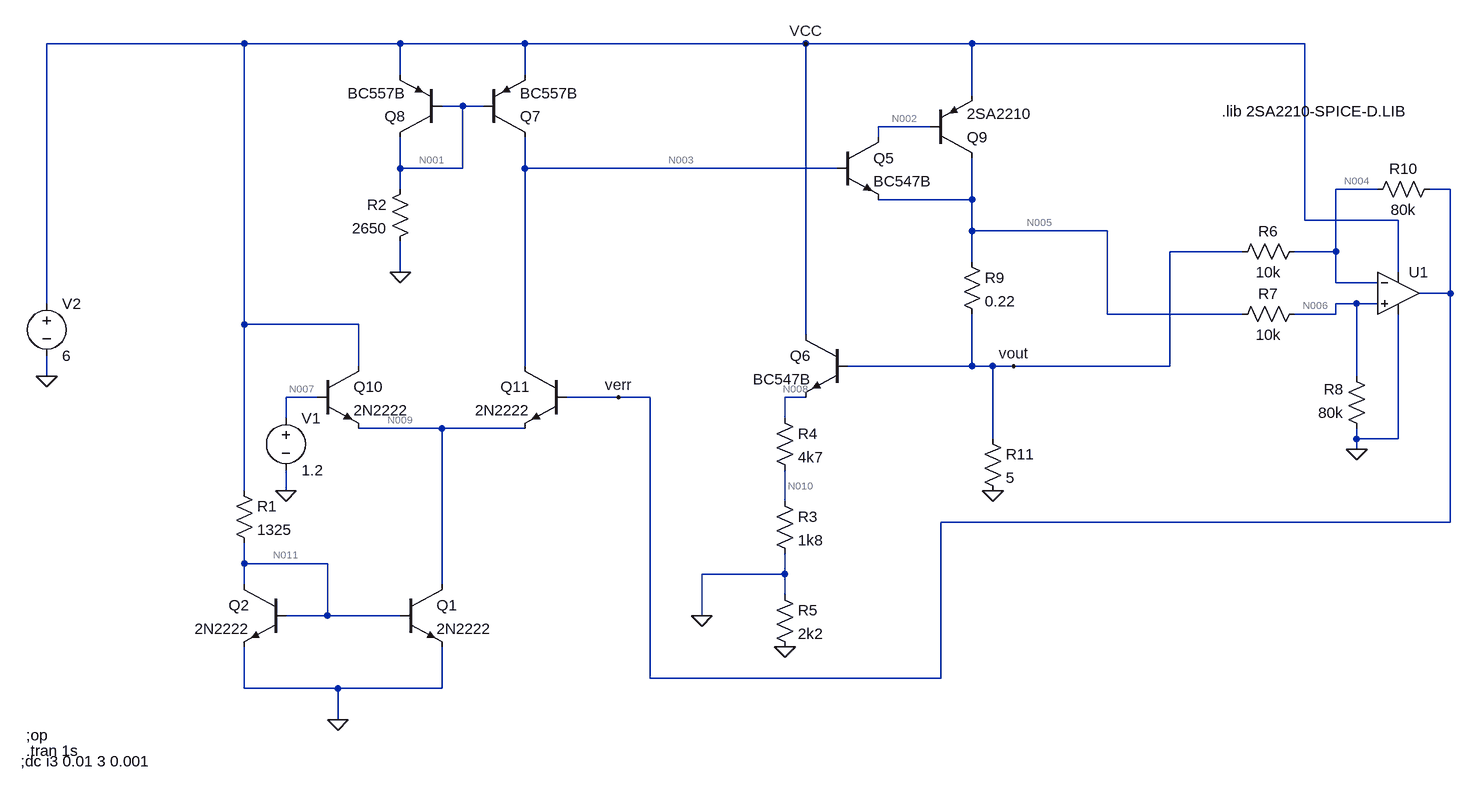
[diagram p0: schematic modelo_1_2_opamp.asc]
modelo_1_2_opamp.asc, the LTspice schematic file:
Version 4
SHEET 1 3060 680
WIRE -128 -496 -432 -496
WIRE 112 -496 -128 -496
WIRE 304 -496 112 -496
WIRE 736 -496 304 -496
WIRE 992 -496 736 -496
WIRE 1504 -496 992 -496
WIRE 112 -448 112 -496
WIRE 304 -448 304 -496
WIRE 992 -416 992 -496
WIRE 208 -400 176 -400
WIRE 240 -400 208 -400
WIRE 928 -368 848 -368
WIRE 848 -352 848 -368
WIRE 112 -304 112 -352
WIRE 208 -304 208 -400
WIRE 208 -304 112 -304
WIRE 304 -304 304 -352
WIRE 784 -304 304 -304
WIRE 112 -272 112 -304
WIRE 1616 -272 1552 -272
WIRE 1728 -272 1696 -272
WIRE 992 -256 992 -320
WIRE 992 -256 848 -256
WIRE 1504 -224 1504 -496
WIRE 1648 -224 1504 -224
WIRE 992 -208 992 -256
WIRE 1200 -208 992 -208
WIRE 1408 -176 1296 -176
WIRE 1552 -176 1552 -272
WIRE 1552 -176 1488 -176
WIRE 992 -160 992 -208
WIRE 112 -144 112 -192
WIRE 1648 -144 1648 -224
WIRE 1552 -128 1552 -176
WIRE 1616 -128 1552 -128
WIRE 1728 -112 1728 -272
WIRE 1728 -112 1680 -112
WIRE -432 -96 -432 -496
WIRE 1584 -96 1552 -96
WIRE 1616 -96 1584 -96
WIRE 1200 -80 1200 -208
WIRE 1408 -80 1200 -80
WIRE 1552 -80 1552 -96
WIRE 1552 -80 1488 -80
WIRE -128 -64 -128 -496
WIRE 48 -64 -128 -64
WIRE 736 -48 736 -496
WIRE 48 0 48 -64
WIRE 304 0 304 -304
WIRE 992 0 992 -80
WIRE 992 0 800 0
WIRE 1024 0 992 0
WIRE 1056 0 1024 0
WIRE 1296 0 1296 -176
WIRE 1296 0 1056 0
WIRE -432 16 -432 -16
WIRE 1584 16 1584 -96
WIRE -16 48 -64 48
WIRE 448 48 368 48
WIRE 496 48 448 48
WIRE 736 48 704 48
WIRE -64 80 -64 48
WIRE 704 80 704 48
WIRE 176 96 48 96
WIRE 304 96 176 96
WIRE 1024 112 1024 0
WIRE 1584 112 1584 96
WIRE 1648 112 1648 -80
WIRE 1648 112 1584 112
WIRE 1584 128 1584 112
WIRE -128 192 -128 -64
WIRE -64 192 -64 160
WIRE 704 208 704 160
WIRE 1728 240 1728 -112
WIRE 1728 240 944 240
WIRE -128 304 -128 272
WIRE 0 304 -128 304
WIRE 704 320 704 288
WIRE 704 320 576 320
WIRE -128 336 -128 304
WIRE 176 336 176 96
WIRE 704 352 704 320
WIRE 0 384 0 304
WIRE 0 384 -64 384
WIRE 112 384 0 384
WIRE 576 384 576 320
WIRE 496 480 496 48
WIRE 944 480 944 240
WIRE 944 480 496 480
WIRE -128 496 -128 432
WIRE 16 496 -128 496
WIRE 176 496 176 432
WIRE 176 496 16 496
WIRE 16 544 16 496
FLAG 16 544 0
FLAG -64 192 0
FLAG -432 16 0
FLAG 112 -144 0
FLAG 1056 0 vout
FLAG 448 48 verr
FLAG 1024 192 0
FLAG 704 432 0
FLAG 736 -496 VCC
FLAG 576 384 0
FLAG 1584 128 0
SYMBOL npn 112 336 R0
SYMATTR InstName Q1
SYMATTR Value 2N2222
SYMBOL npn -64 336 M0
SYMATTR InstName Q2
SYMATTR Value 2N2222
SYMBOL npn 784 -352 R0
SYMATTR InstName Q5
SYMATTR Value BC547B
SYMBOL pnp 240 -352 M180
SYMATTR InstName Q7
SYMATTR Value BC557B
SYMBOL pnp 176 -352 R180
SYMATTR InstName Q8
SYMATTR Value BC557B
SYMBOL res -144 176 R0
SYMATTR InstName R1
SYMATTR Value 1325
SYMBOL res 128 -288 M0
SYMATTR InstName R2
SYMATTR Value 2650
SYMBOL pnp 928 -320 M180
SYMATTR InstName Q9
SYMATTR Value 2SA2210
SYMBOL voltage -64 64 R0
WINDOW 123 0 0 Left 0
WINDOW 39 0 0 Left 0
SYMATTR InstName V1
SYMATTR Value 1.2
SYMBOL voltage -432 -112 R0
WINDOW 123 0 0 Left 0
WINDOW 39 0 0 Left 0
SYMATTR InstName V2
SYMATTR Value 6
SYMBOL npn 800 -48 M0
SYMATTR InstName Q6
SYMATTR Value BC547B
SYMBOL res 688 64 R0
SYMATTR InstName R4
SYMATTR Value 4k7
SYMBOL res 688 192 R0
SYMATTR InstName R3
SYMATTR Value 1k8
SYMBOL res 688 336 R0
SYMATTR InstName R5
SYMATTR Value 2k2
SYMBOL res 976 -176 R0
SYMATTR InstName R9
SYMATTR Value 0.22
SYMBOL npn -16 0 R0
SYMATTR InstName Q10
SYMATTR Value 2N2222
SYMBOL npn 368 0 M0
SYMATTR InstName Q11
SYMATTR Value 2N2222
SYMBOL res 1504 -192 R90
WINDOW 0 0 56 VBottom 2
WINDOW 3 32 56 VTop 2
SYMATTR InstName R6
SYMATTR Value 10k
SYMBOL res 1504 -96 R90
WINDOW 0 0 56 VBottom 2
WINDOW 3 32 56 VTop 2
SYMATTR InstName R7
SYMATTR Value 10k
SYMBOL res 1600 112 R180
WINDOW 0 36 76 Left 2
WINDOW 3 36 40 Left 2
SYMATTR InstName R8
SYMATTR Value 80k
SYMBOL res 1600 -256 R270
WINDOW 0 32 56 VTop 2
WINDOW 3 0 56 VBottom 2
SYMATTR InstName R10
SYMATTR Value 80k
SYMBOL OpAmps\\UniversalOpAmp 1648 -112 R0
SYMATTR InstName U1
SYMBOL res 1008 96 R0
SYMATTR InstName R11
SYMATTR Value 5
TEXT -464 568 Left 2 !;op
TEXT -464 592 Left 2 !.tran 1s
TEXT -472 608 Left 2 !;dc i3 0.01 3 0.001
TEXT 1376 -392 Left 2 !.lib 2SA2210-SPICE-D.LIB

The netlist it stands for:
* modelo_1_2_opamp.asc
Q1 N009 N011 0 0 2N2222
Q2 N011 N011 0 0 2N2222
Q5 N002 N003 N005 0 BC547B
Q7 N003 N001 VCC 0 BC557B
Q8 N001 N001 VCC 0 BC557B
R1 VCC N011 1325
R2 N001 0 2650
Q9 N005 N002 VCC 0 2SA2210
V1 N007 0 1.2
V2 VCC 0 6
Q6 VCC vout N008 0 BC547B
R4 N008 N010 4k7
R3 N010 0 1k8
R5 0 0 2k2
R9 N005 vout 0.22
Q10 VCC N007 N009 0 2N2222
Q11 N003 verr N009 0 2N2222
R6 N004 vout 10k
R7 N006 N005 10k
R8 0 N006 80k
R10 N004 verr 80k
XU1 N006 N004 VCC 0 verr level1 Avol=1Meg GBW=10Meg Vos=0 En=0 Enk=0 In=0 Ink=0 Rin=500Meg  ; pins In+ In- V+ V- OUT
R11 vout 0 5
.model NPN NPN
.model PNP PNP
.lib standard.bjt
;op
.tran 1s
;dc i3 0.01 3 0.001
.lib 2SA2210-SPICE-D.LIB
.lib UniversalOpAmp1.lib
.backanno
.end

* Results of the author's LTspice run, read from the files saved beside the schematic
* Operating Point, zero values left out:
*   V(n009) = 529.7 mV
*   V(n011) = 692.1 mV
*   V(n002) = 5.347 V
*   V(n003) = 4.235 V
*   V(n005) = 3.571 V
*   V(n001) = 5.354 V
*   V(vcc) = 6 V
*   V(n007) = 1.2 V
*   V(vout) = 3.42 V
*   V(n008) = 2.805 V
*   V(n010) = 776.7 mV
*   V(verr) = 1.204 V
*   V(n004) = 3.174 V
*   V(n006) = 3.174 V
*   Ic(Q9) = -681.6 mA
*   Ib(Q9) = -2.531 mA
*   Ie(Q9) = 684.1 mA
*   Ic(Q8) = -2.008 mA
*   Ib(Q8) = -6.25 µA
*   Ie(Q8) = 2.014 mA
*   Ic(Q7) = -2.111 mA
*   Ib(Q7) = -6.235 µA
*   Ie(Q7) = 2.118 mA
*   Ic(Q6) = 430.1 µA
*   Ib(Q6) = 1.459 µA
*   Ie(Q6) = -431.5 µA
*   Ic(Q5) = 2.531 mA
*   Ib(Q5) = 8.892 µA
*   Ie(Q5) = -2.54 mA
*   Ic(Q11) = 2.103 mA
*   Ib(Q11) = 10.27 µA
*   Ie(Q11) = -2.113 mA
*   Ic(Q10) = 1.838 mA
*   Ib(Q10) = 8.82 µA
*   Ie(Q10) = -1.847 mA
*   Ic(Q2) = 3.966 mA
*   Ib(Q2) = 20.09 µA
*   Ie(Q2) = -3.986 mA
*   Ic(Q1) = 3.96 mA
*   Ib(Q1) = 20.09 µA
*   Ie(Q1) = -3.98 mA
*   I(R11) = 684.1 mA
*   I(R10) = 24.63 µA
*   I(R8) = -39.68 µA
*   I(R7) = -39.68 µA
*   I(R6) = -24.63 µA
*   I(R9) = 684.1 mA
*   I(R3) = 431.5 µA
*   I(R4) = 431.5 µA
*   I(R2) = 2.02 mA
*   I(R1) = 4.006 mA
*   I(V2) = -694.5 mA
*   I(V1) = -8.82 µA
*   Ix(u1:1) = 348.2 pA
*   Ix(u1:2) = 348.2 pA
*   Ix(u1:3) = 5.652 nA
*   Ix(u1:4) = -6.348 nA
*   Ix(u1:5) = 14.36 µA